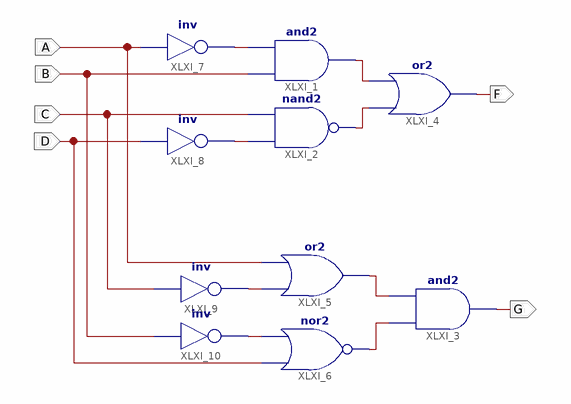
[diagram p0: schematic sheet 1]
// Xilinx ISE schematic sch.sch (artix7) as structural Verilog: 10 symbols, 6 ports
module sch (
  input  B,
  input  C,
  input  A,
  input  D,
  output F,
  output G
);

  wire XLXN_1, XLXN_2, XLXN_3, XLXN_4, XLXN_5, XLXN_6, XLXN_7, XLXN_8;

  and XLXI_1 (XLXN_7, B, XLXN_2);
  nand XLXI_2 (XLXN_8, XLXN_1, C);
  and XLXI_3 (G, XLXN_6, XLXN_5);
  or XLXI_4 (F, XLXN_8, XLXN_7);
  or XLXI_5 (XLXN_5, XLXN_3, A);
  nor XLXI_6 (XLXN_6, D, XLXN_4);
  not XLXI_7 (XLXN_2, A);
  not XLXI_8 (XLXN_1, D);
  not XLXI_9 (XLXN_3, C);
  not XLXI_10 (XLXN_4, B);
endmodule
